# EasyEDA Pro project STM32设计.eprj

# Schematic STM32系统
Create Date: 2024-05-22; Page Name: P1; Project Name: STM32设计; Schematic Name: STM32系统; Update Date: 2024-09-18; Company: WWC; Page Size: A4; Version: V1.0
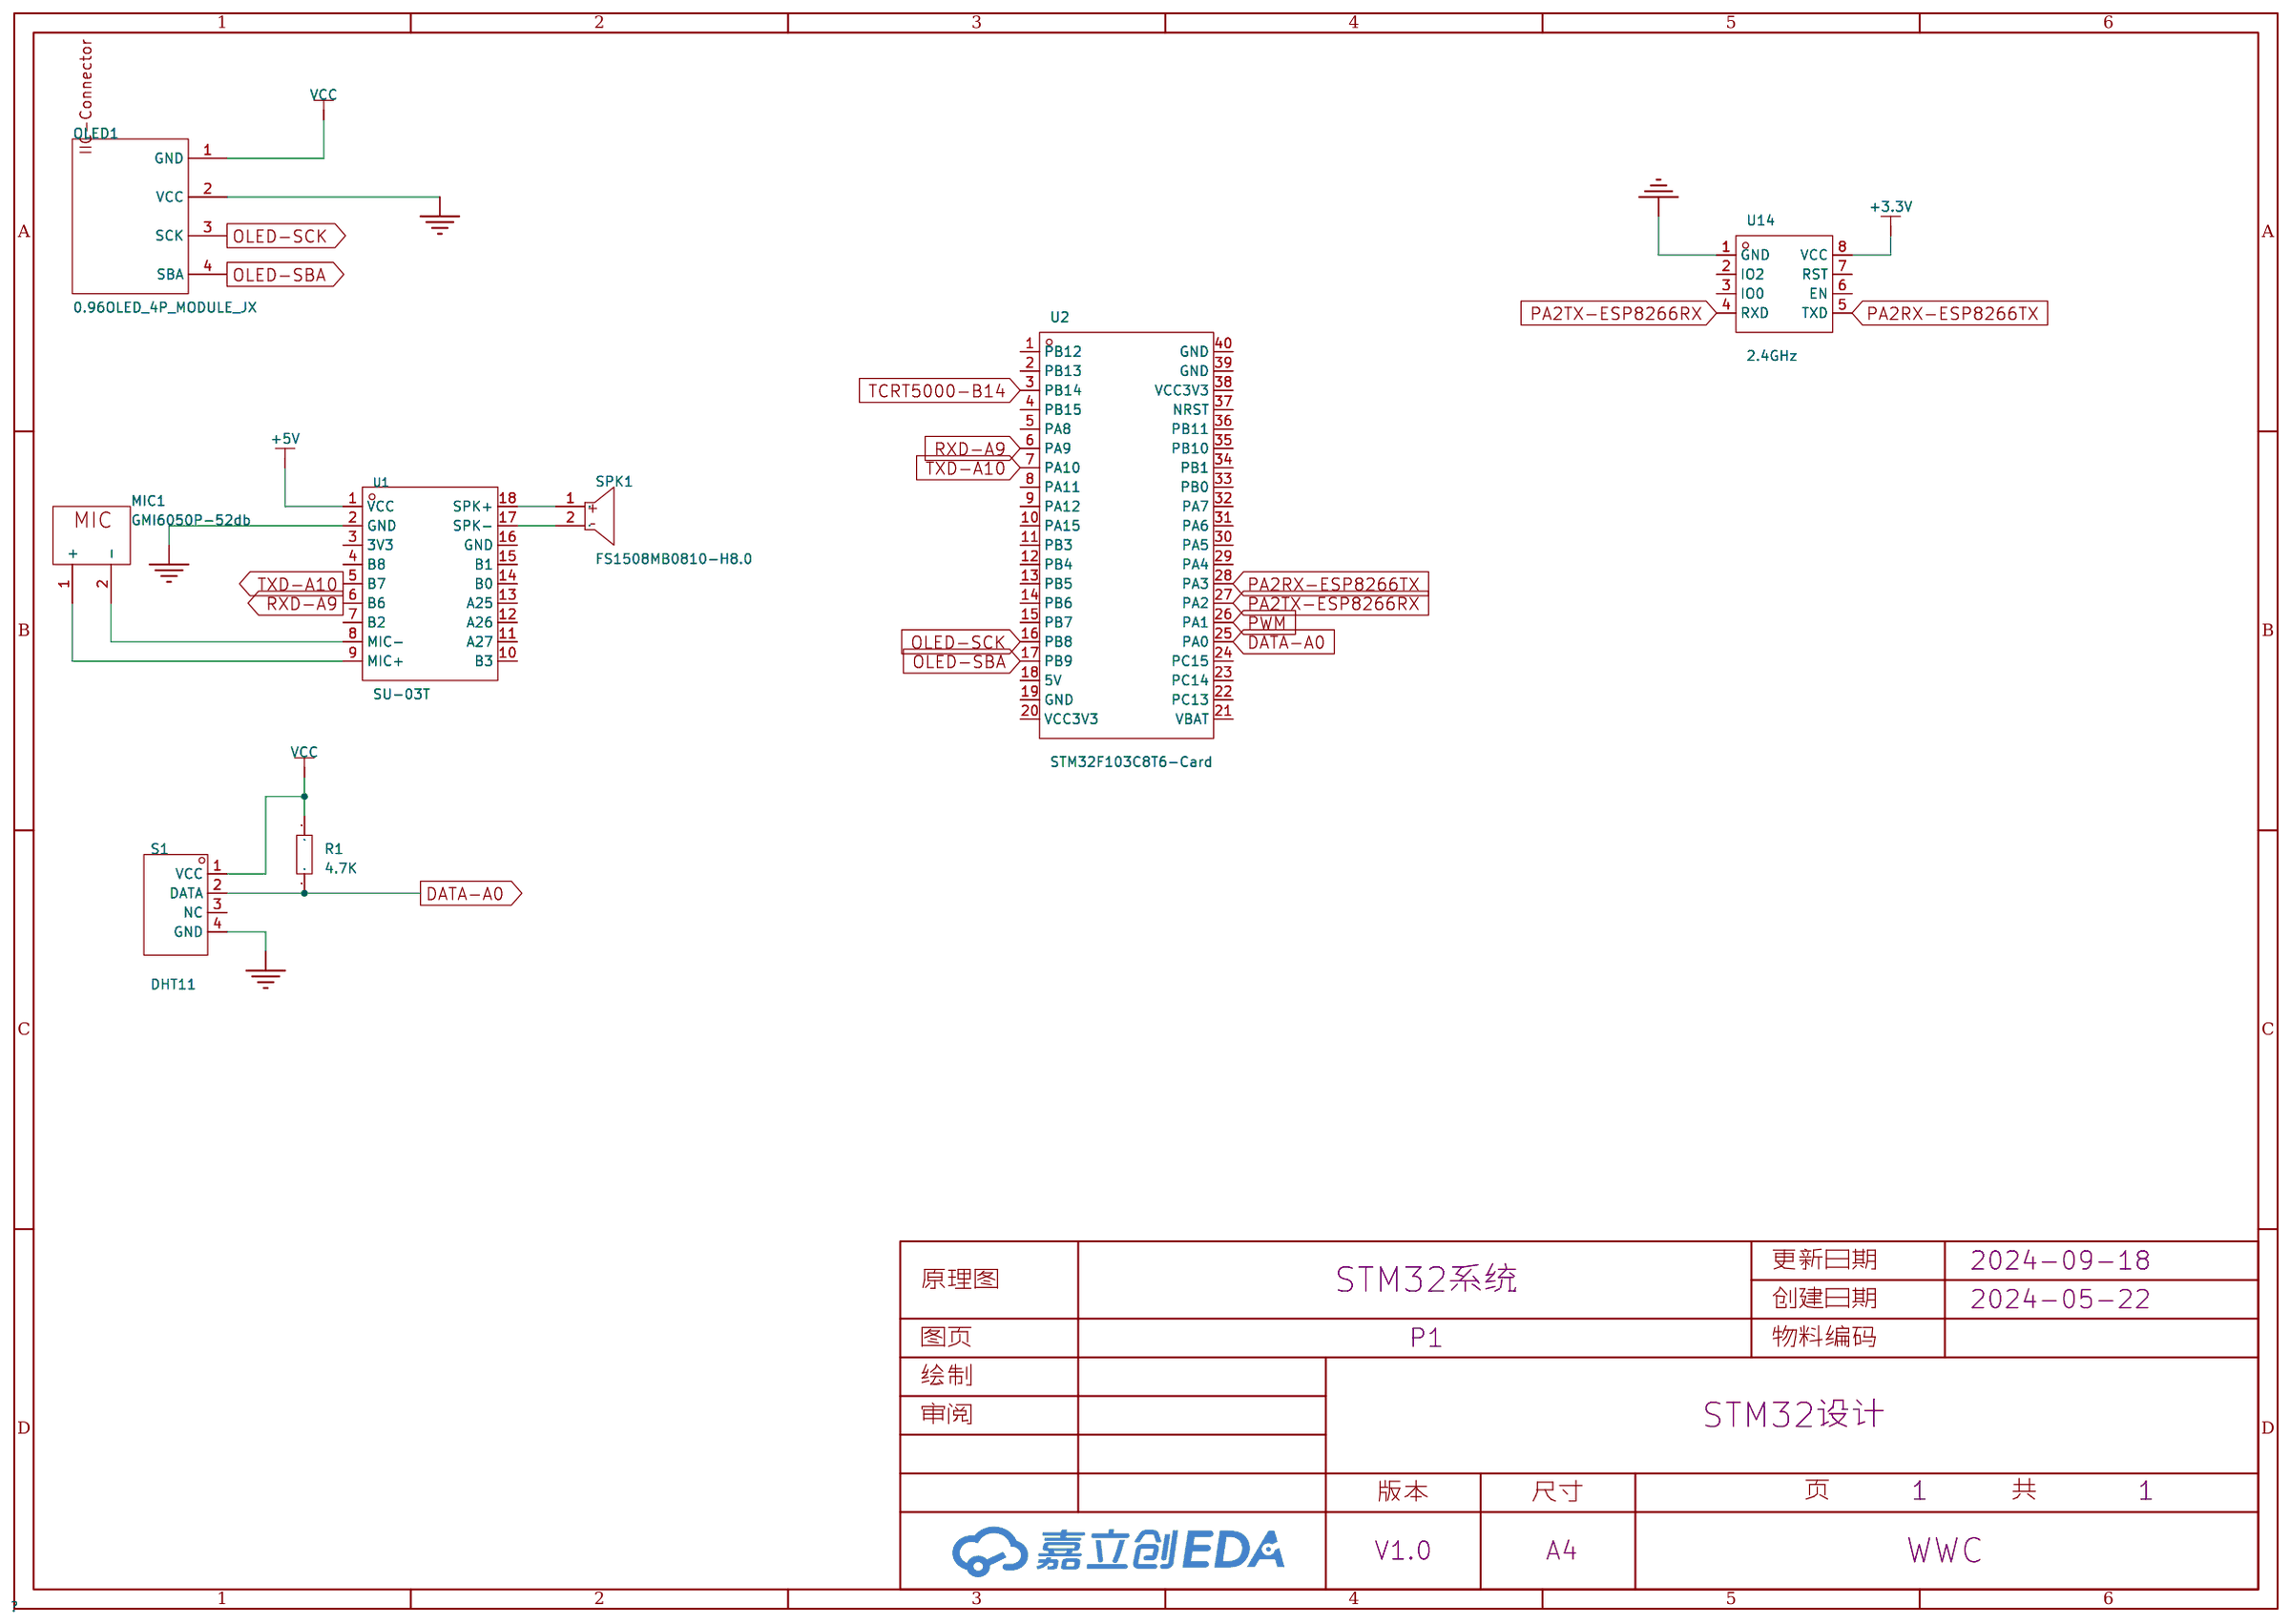
[diagram p0: schematic sheet]

## Parts
MIC1  GMI6050P-52db  [MIC-TH_BD6.0-P2.00]
OLED1  0.96OLED_4P_MODULE_JX  [0.96OLED_4P]
R1  4.7K  [R0805]
S1  DHT11  [SENSOR-TH_DHT11-1]
SPK1  FS1508MB0810-H8.0  [BEEP-TH_BD15.0-P10.20-D1.2]
U1  SU-03T  [COMM-SMD_18P-L21.0-W15.0-P2.00]
U2  STM32F103C8T6-Card  [CONN-TH_L53.3-W22.9_STM32F103C8T6-CARD]
U14  2.4GHz  [WIFIM-TH_8P-L24.7-W14.4-P2.54]

## Library data of the parts
MIC1 = GMI6050P-52db: LCSC Part Name: 全指向φ6.0*5.0mm 1.5V-10V 灵敏度-52db 低阻抗 针脚; Supplier Part: C233947; Manufacturer: INGHAi(赢海); Supplier Footprint: 插件,D=6mm; JLCPCB Part Class: 扩展库; Datasheet: https://atta.szlcsc.com/upload/public/pdf/source/20180613/C233951_CF3F103FE3546E5F8FCD1BC0597FF08F.pdf; Supplier: LCSC
OLED1 = 0.96OLED_4P_MODULE_JX: Supplier Part: C9900004566; Supplier Footprint: 插件; JLCPCB Part Class: 扩展库; Supplier: LCSC
R1 = RMC08054.7K5%N: 阻值:4.7kΩ;精度:±5%;功率:125mW;; LCSC Part Name: 4.7kΩ ±5% 125mW; Supplier Part: C269733; Manufacturer: Tyohm(幸亚电阻); Supplier Footprint: 0805; JLCPCB Part Class: 扩展库; Datasheet: https://atta.szlcsc.com/upload/public/pdf/source/20190115/C325956_D27151D492FFB3C9AB4A6F14FE01F30A.pdf; Supplier: LCSC; Tolerance: ±5%; Power(Watts): 125mW
S1 = DHT11_C87032: 温湿度模块，数字式，单总线; LCSC Part Name: DHT11  电阻式; Supplier Part: C87032; Supplier Footprint: 16.1x12.6x5.8mm; JLCPCB Part Class: 扩展库; Supplier: LCSC
SPK1 = FS1508MB0810-H8.0: 插针; LCSC Part Name: 喇叭; Supplier Part: C969972; Manufacturer: FUET(福声科技); JLCPCB Part Class: 扩展库; Datasheet: https://atta.szlcsc.com/upload/public/pdf/source/20201214/C969972_AF680FD4EA01CCA3A240B6D561BC4FD9.pdf; Supplier: LCSC
U1 = SU-03T: 处理器:-;运行内存:-;USB:-;WIFI协议:-;蓝牙:-;以太网:-;; Supplier Part: C879203; Manufacturer: MACHINE INTELLIGENCE(机芯智能); JLCPCB Part Class: 扩展库; Datasheet: https://atta.szlcsc.com/upload/public/pdf/source/20201029/C879203_F32AEAE676882DD706CDA0C6D57F9671.pdf; Supplier: LCSC
U2 = STM32F103C8T6-Card: Supplier Part: C9900077949; Supplier Footprint: 插件; Supplier: LCSC
U14 = ESP-01S: 核心处理器:ESP8266芯片;频率:2.4GHz;天线形式:板载PCB天线;发射功率:16dBm;接收灵敏度:-90dBm;; LCSC Part Name: 完整的802.11b/g/nWi-FiSoC模块; Supplier Part: C503582; Manufacturer: Ai-Thinker(安信可); JLCPCB Part Class: 扩展库; Datasheet: https://atta.szlcsc.com/upload/public/pdf/source/20200407/C503582_1139AF8FB42E05635FA0089E1752A536.pdf; Supplier: LCSC; Core Processor: ESP8266芯片; Support Interface: GPIO；UART；PWM; Antenna Type: 板载PCB天线; Output Power: 16dBm; Operating Voltage: 3V~3.6V; Receive  Current: 56mA; Send  Current: 170mA; Sensitivity: -90dBm; Operating Temperature: -20℃~+70℃

## Nets
+3.3V: U14.8(VCC)
+5V: U1.1(VCC)
GND: OLED1.2(VCC) S1.4(GND) U1.2(GND) U14.1(GND)
VCC: OLED1.1(GND) R1.2 S1.1(VCC)
DATA-A0: R1.1 S1.2(DATA) U2.25(PA0)
OLED-SBA: OLED1.4(SBA) U2.17(PB9)
OLED-SCK: OLED1.3(SCK) U2.16(PB8)
PA2RX-ESP8266TX: U2.28(PA3) U14.5(TXD)
PA2TX-ESP8266RX: U2.27(PA2) U14.4(RXD)
PWM: U2.26(PA1)
RXD-A9: U1.6(B6) U2.6(PA9)
TCRT5000-B14: U2.3(PB14)
TXD-A10: U1.5(B7) U2.7(PA10)
$1N2667: MIC1.1(+) U1.9(MIC+)
$1N2671: MIC1.2(-) U1.8(MIC-)
$1N2735: SPK1.1 U1.18(SPK+)
$1N2739: SPK1.2 U1.17(SPK-)

Not connected (* = marked no-connect by the designer): S1 3(NC); U1 3(3V3) 4(B8) 7(B2) 10(B3) 11(A27) 12(A26) 13(A25) 14(B0) 15(B1) 16(GND); U2 1(PB12) 2(PB13) 4(PB15) 5(PA8) 8(PA11) 9(PA12) 10(PA15) 11(PB3) 12(PB4) 13(PB5) 14(PB6) 15(PB7) 18(5V) 19(GND) 20(VCC3V3) 21(VBAT) 22(PC13) 23(PC14) 24(PC15) 29(PA4) 30(PA5) 31(PA6) 32(PA7) 33(PB0) 34(PB1) 35(PB10) 36(PB11) 37(NRST) 38(VCC3V3) 39(GND) 40(GND); U14 2(IO2) 3(IO0) 6(EN) 7(RST)

# Schematic Schematic1
Create Date: 2024-09-17; Page Name: P1; Project Name: STM32设计; Schematic Name: Schematic1; Update Date: 2024-09-18; Company: WWC; Page Size: A4; Version: V1.0
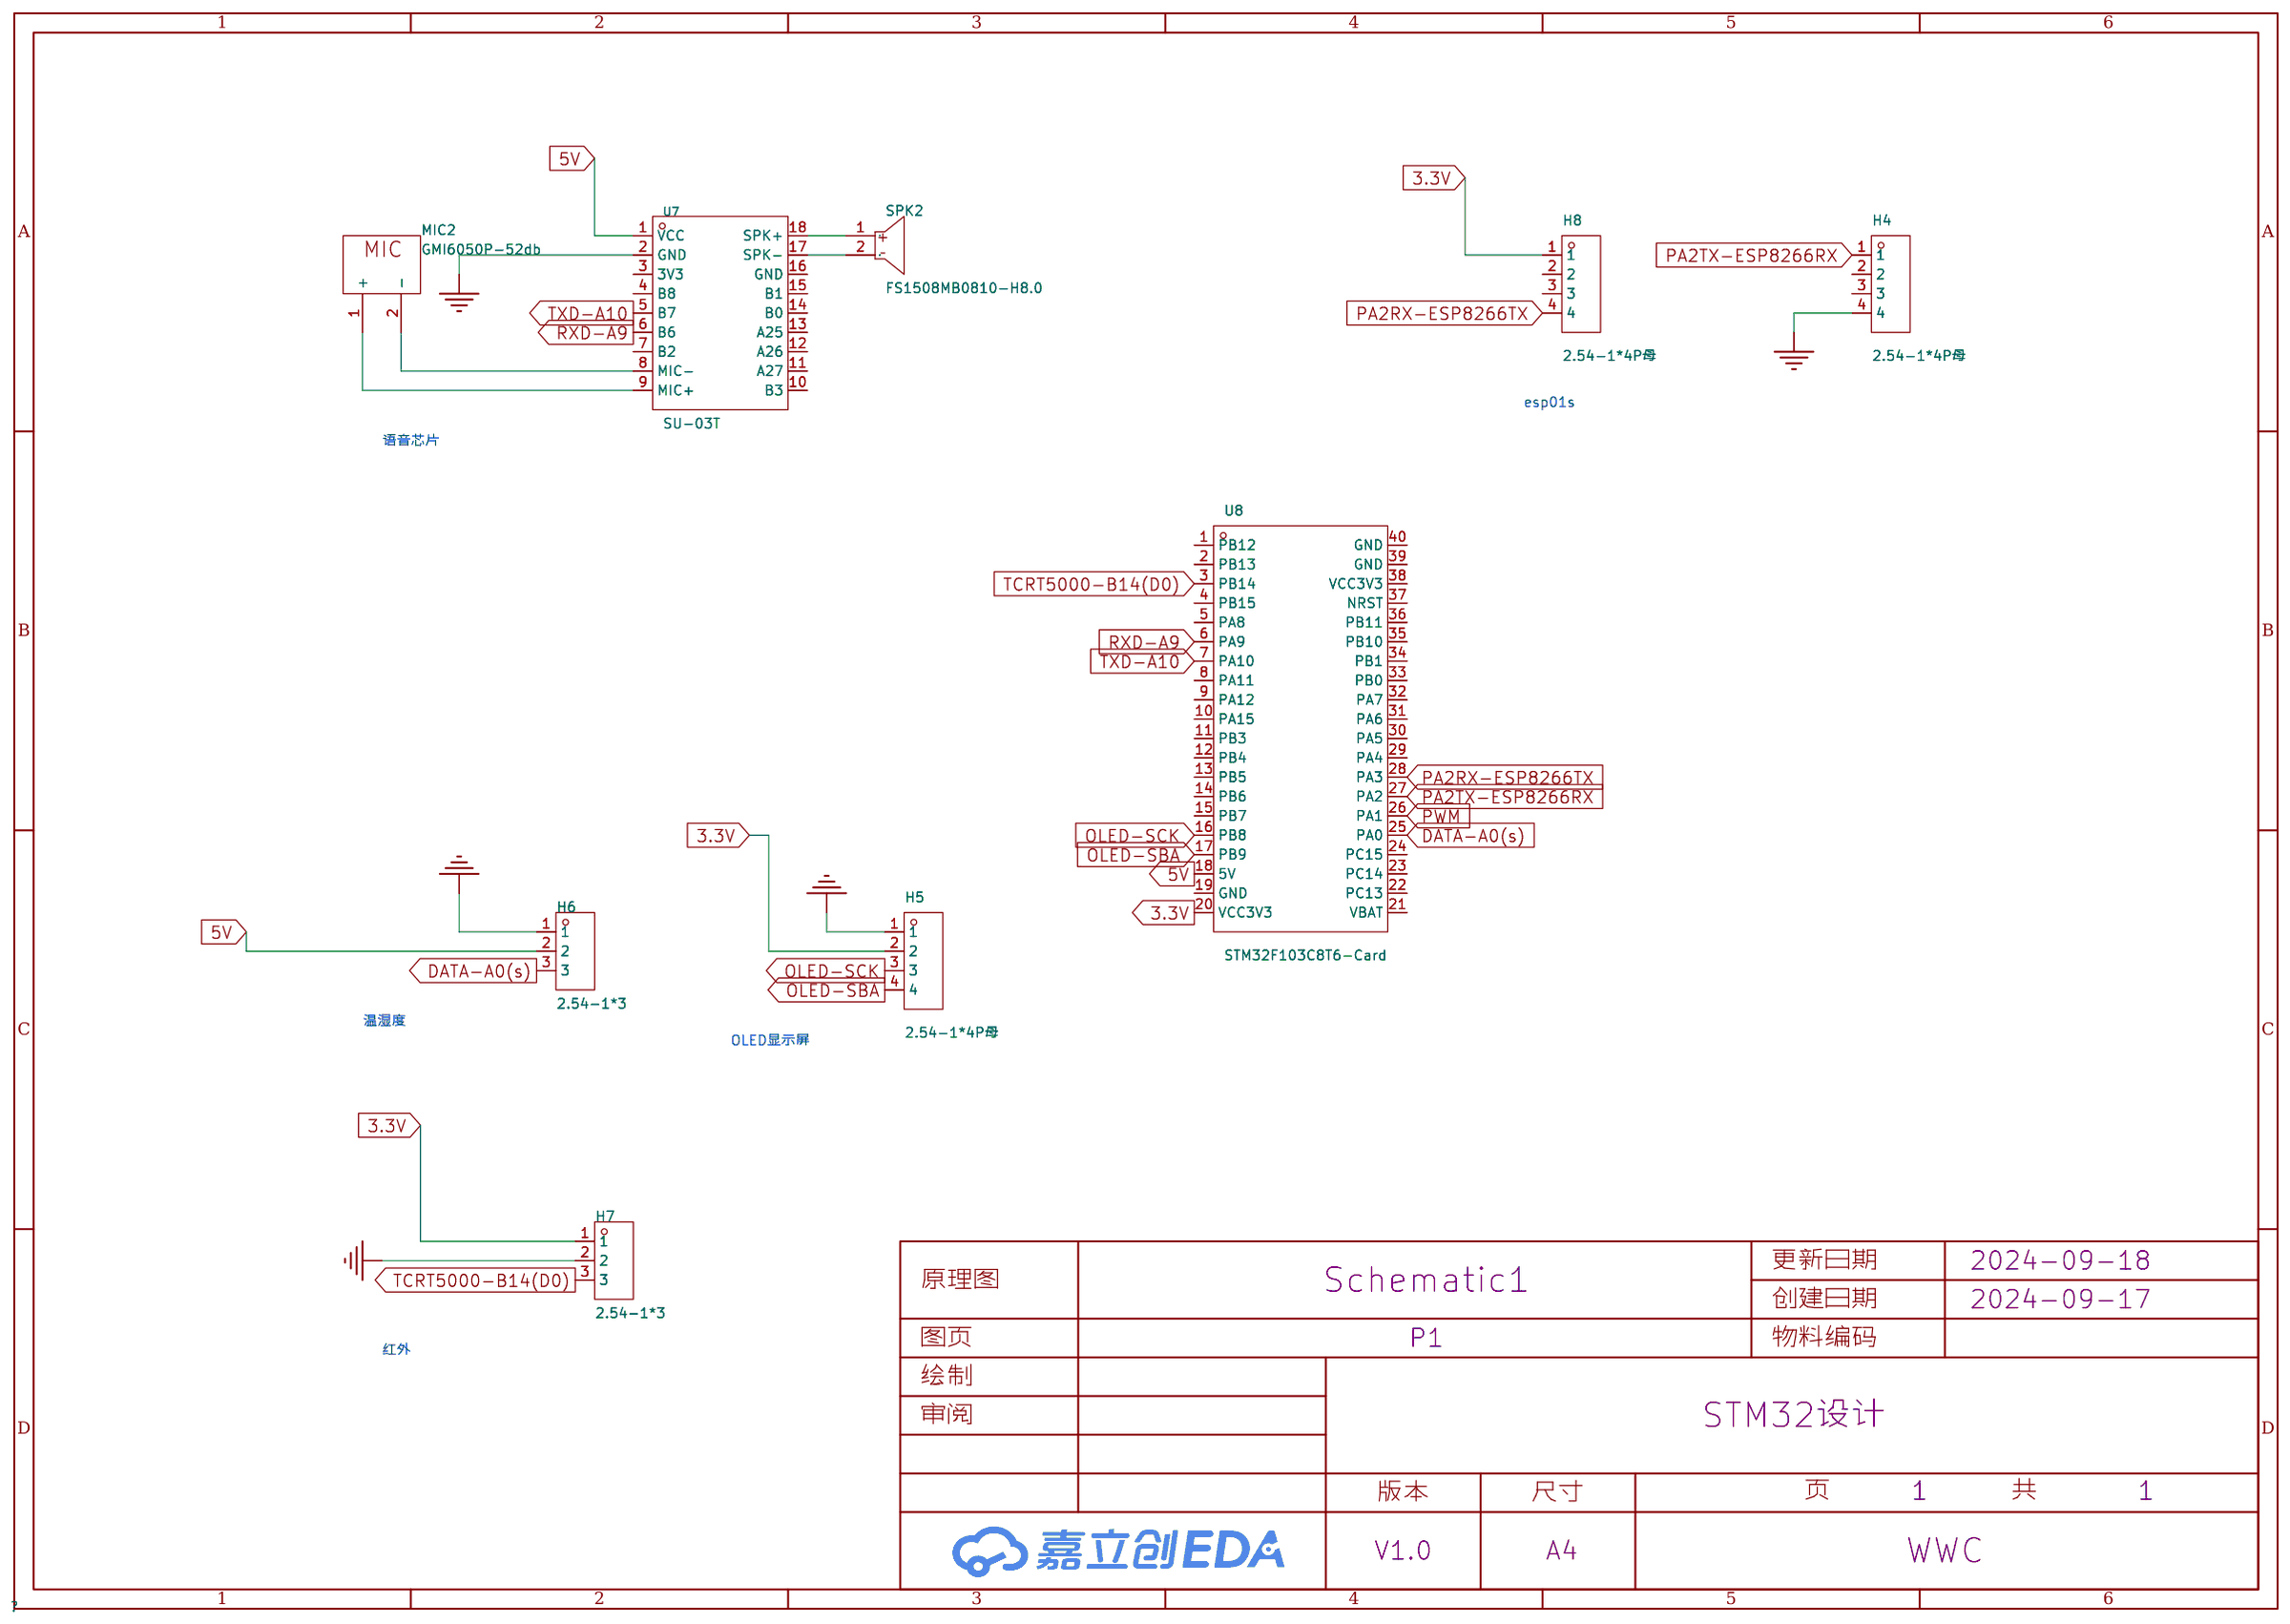
[diagram p1: schematic sheet]

## Parts
H4  2.54-1*4P母  [HDR-TH_4P-P2.54-V-F]
H5  2.54-1*4P母  [HDR-TH_4P-P2.54-V-F]
H6  2.54-1*3  [HDR-TH_3P-P2.54-V-M-1]
H7  2.54-1*3  [HDR-TH_3P-P2.54-V-M-1]
H8  2.54-1*4P母  [HDR-TH_4P-P2.54-V-F]
MIC2  GMI6050P-52db  [MIC-TH_BD6.0-P2.00]
SPK2  FS1508MB0810-H8.0  [BEEP-TH_BD15.0-P10.20-D1.2]
U7  SU-03T  [COMM-SMD_18P-L21.0-W15.0-P2.00]
U8  STM32F103C8T6-Card  [CONN-TH_L53.3-W22.9_STM32F103C8T6-CARD]

## Library data of the parts
H4 H5 H8 = 2.54-1*4P母: 插孔结构:1x4P;间距:2.54mm;行距:-;圆孔/方孔:方孔;安装类型:直插;排数:单排;总孔位数:4P;额定电流:3A;额定电压:-;插孔方向:顶部;塑高:-;触头材质:青铜;触头镀层:-;工作温度范围:-40℃~+105℃;焊接温度(最大值):-;; LCSC Part Name: 间距:2.54mm 1x4P 直插; Supplier Part: C2718488; Manufacturer: BOOMELE(博穆精密); Supplier Footprint: 插件,P=2.54mm; JLCPCB Part Class: 扩展库; Datasheet: https://atta.szlcsc.com/upload/public/pdf/source/20210301/C2718488_F4427B881E42CAA8DDB0B1C12B3A522C.pdf; Supplier: LCSC; Holes Structure: 1x4P; Pitch: 2.54mm; Circular Hole / Square Hole: 方孔; Mounting Type: 直插; Number of Rows: 单排; Number of Holes: 4P; Current Rating (Max): 3A; Holes Direction: 顶部; Contact Material: 青铜; Operating Temperature Range: -40℃~+105℃
H6 H7 = 2.54-1*3: 插针结构:1x3P;间距:2.54mm;排数:单排;总PIN位数:3P;触头镀层:金;; LCSC Part Name: 停产; Supplier Part: C5116482; Manufacturer: ZHOURI(洲日); Supplier Footprint: 插件,P=2.54mm; JLCPCB Part Class: 扩展库; Datasheet: https://atta.szlcsc.com/upload/public/pdf/source/20220729/4DB71EF9013296CFACD97372BAB8A1F0.pdf; Supplier: LCSC; Pin Structure: 1x3P; Pitch: 2.54mm; Number of Rows: 单排; Number of Pins: 3P; Contact Plating: 金
MIC2 = GMI6050P-52db: LCSC Part Name: 全指向φ6.0*5.0mm 1.5V-10V 灵敏度-52db 低阻抗 针脚; Supplier Part: C233947; Manufacturer: INGHAi(赢海); Supplier Footprint: 插件,D=6mm; JLCPCB Part Class: 扩展库; Datasheet: https://atta.szlcsc.com/upload/public/pdf/source/20180613/C233951_CF3F103FE3546E5F8FCD1BC0597FF08F.pdf; Supplier: LCSC
SPK2 = FS1508MB0810-H8.0: 插针; LCSC Part Name: 喇叭; Supplier Part: C969972; Manufacturer: FUET(福声科技); JLCPCB Part Class: 扩展库; Datasheet: https://atta.szlcsc.com/upload/public/pdf/source/20201214/C969972_AF680FD4EA01CCA3A240B6D561BC4FD9.pdf; Supplier: LCSC
U7 = SU-03T: 处理器:-;运行内存:-;USB:-;WIFI协议:-;蓝牙:-;以太网:-;; Supplier Part: C879203; Manufacturer: MACHINE INTELLIGENCE(机芯智能); JLCPCB Part Class: 扩展库; Datasheet: https://atta.szlcsc.com/upload/public/pdf/source/20201029/C879203_F32AEAE676882DD706CDA0C6D57F9671.pdf; Supplier: LCSC
U8 = STM32F103C8T6-Card: Supplier Part: C9900077949; Supplier Footprint: 插件; Supplier: LCSC

## Nets
3.3V: H5.2 H7.1 H8.1 U8.20(VCC3V3)
5V: H6.2 U7.1(VCC) U8.18(5V)
GND: H4.4 H5.1 H6.1 H7.2 U7.2(GND)
DATA-A0(s): H6.3 U8.25(PA0)
OLED-SBA: H5.4 U8.17(PB9)
OLED-SCK: H5.3 U8.16(PB8)
PA2RX-ESP8266TX: H8.4 U8.28(PA3)
PA2TX-ESP8266RX: H4.1 U8.27(PA2)
PWM: U8.26(PA1)
RXD-A9: U7.6(B6) U8.6(PA9)
TCRT5000-B14(D0): H7.3 U8.3(PB14)
TXD-A10: U7.5(B7) U8.7(PA10)
$1N804: MIC2.1(+) U7.9(MIC+)
$1N805: MIC2.2(-) U7.8(MIC-)
$1N806: SPK2.1 U7.18(SPK+)
$1N807: SPK2.2 U7.17(SPK-)

Not connected (* = marked no-connect by the designer): H4 2 3; H8 2 3; U7 3(3V3) 4(B8) 7(B2) 10(B3) 11(A27) 12(A26) 13(A25) 14(B0) 15(B1) 16(GND); U8 1(PB12) 2(PB13) 4(PB15) 5(PA8) 8(PA11) 9(PA12) 10(PA15) 11(PB3) 12(PB4) 13(PB5) 14(PB6) 15(PB7) 19(GND) 21(VBAT) 22(PC13) 23(PC14) 24(PC15) 29(PA4) 30(PA5) 31(PA6) 32(PA7) 33(PB0) 34(PB1) 35(PB10) 36(PB11) 37(NRST) 38(VCC3V3) 39(GND) 40(GND)

## Notes on the sheet
- esp01s
- 语音芯片
- 温湿度
- OLED显示屏
- 红外

# Board PCB1
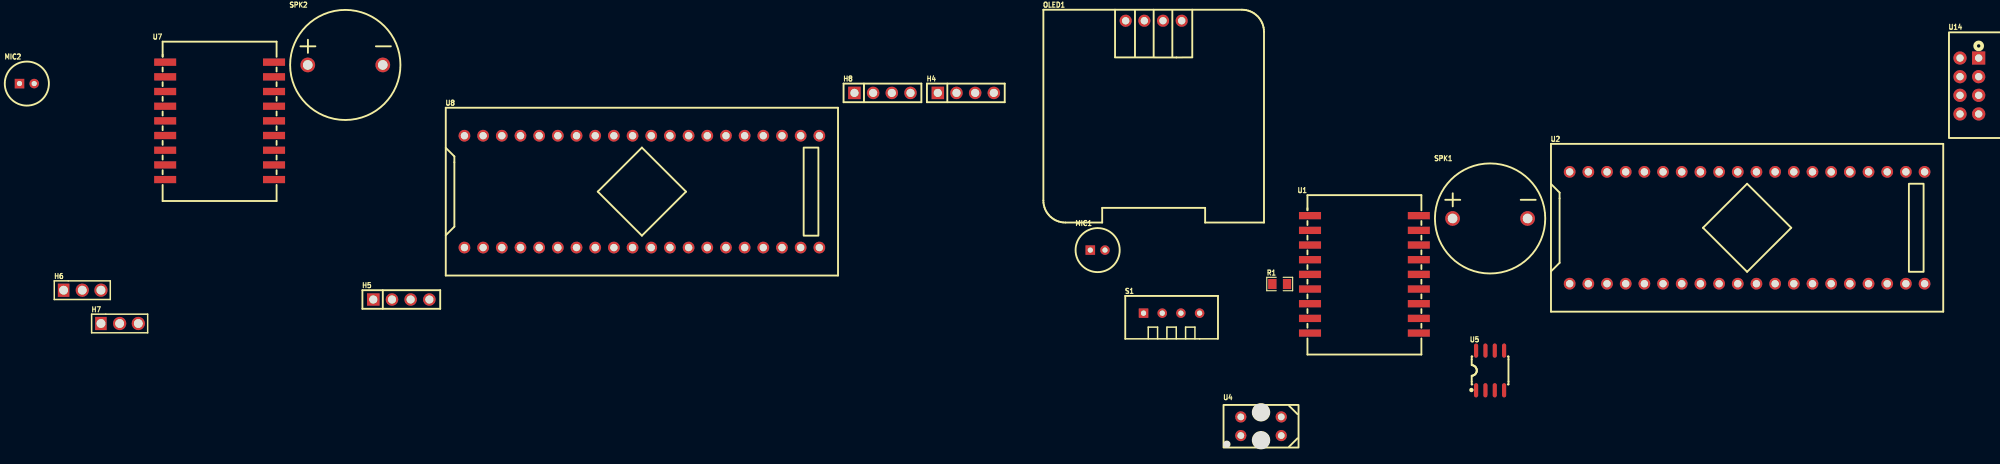
[diagram p2: board, top side]
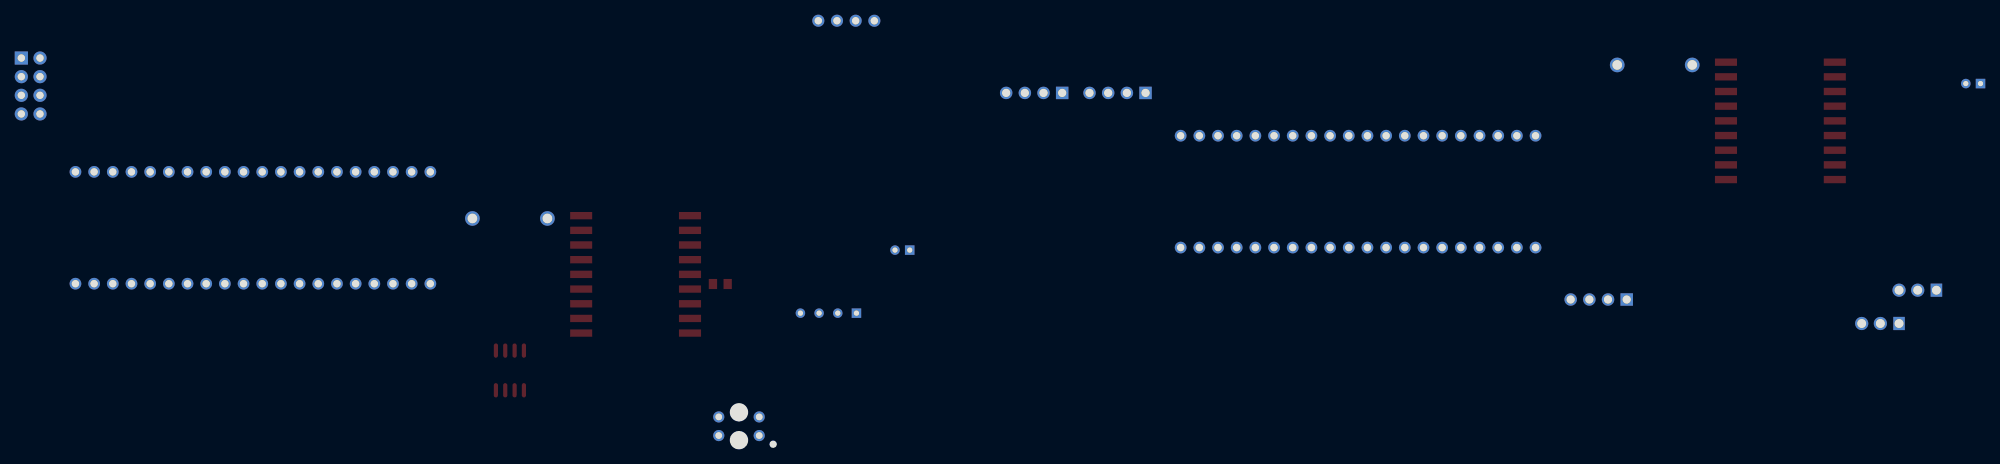
[diagram p3: board, bottom side, seen from below]

Outline 6.39 x 6.29 mm; copper layers: Top Layer, Bottom Layer. Coordinates in mm from the lower left corner of the outline.
Stack: Top Layer 0.035mm / Dielectric1 1.51mm FR4 er 4.5 / Bottom Layer 0.035mm

## Design rules (mm)
template: JLCPCB Capability(Two Layers Board)
spacing copperThickness1oz (default): track to track 0.102, other pairs 0.152 to 0.3
spacing copperThickness2oz: track to track 0.203, other pairs 0.152 to 0.3
track width copperThickness1oz (default): min 0.127, default 0.254, max 2.54
track width copperThickness2oz: min 0.203, default 0.254, max 2.54
differential pair differentialPair (default): width min 0.127, default 0.254, max 2.54; gap min 0.152, default 0.152
via viaSize (default): diameter min 0.5, default 0.61, max 10; hole min 0.3, default 0.305, max 6.3

## Placement (name value [footprint] x y rotation side)
H4  2.54-1*4P母  [HDR-TH_4P-P2.54-V-F]  -35 48.57 0 top
H5  2.54-1*4P母  [HDR-TH_4P-P2.54-V-F]  -111.76 20.41 0 top
H6  2.54-1*3  [HDR-TH_3P-P2.54-V-M-1]  -155.14 21.68 0 top
H7  2.54-1*3  [HDR-TH_3P-P2.54-V-M-1]  -150.06 17.15 0 top
H8  2.54-1*4P母  [HDR-TH_4P-P2.54-V-F]  -46.33 48.57 0 top
MIC1  GMI6050P-52db  [MIC-TH_BD6.0-P2.00]  -17.07 27.15 0 top
MIC2  GMI6050P-52db  [MIC-TH_BD6.0-P2.00]  -162.68 49.84 0 top
OLED1  0.96OLED_4P_MODULE_JX  [0.96OLED_4P]  -9.45 58.4 0 top
R1  4.7K  [R0805]  7.69 22.53 0 top
S1  DHT11  [SENSOR-TH_DHT11-1]  -7.02 18.56 0 top
SPK1  FS1508MB0810-H8.0  [BEEP-TH_BD15.0-P10.20-D1.2]  36.29 31.46 0 top
SPK2  FS1508MB0810-H8.0  [BEEP-TH_BD15.0-P10.20-D1.2]  -119.38 52.38 0 top
U1  SU-03T  [COMM-SMD_18P-L21.0-W15.0-P2.00]  19.21 23.84 0 top
U2  STM32F103C8T6-Card  [CONN-TH_L53.3-W22.9_STM32F103C8T6-CARD]  71.24 30.19 0 top
U4  TCRT5000  [OPTO-TH_TCRT5000]  5.15 3.15 0 top
U5  LM393DR2G  [SOIC-8_L5.0-W4.0-P1.27-LS6.0-BL]  36.29 10.75 0 top
U7  SU-03T  [COMM-SMD_18P-L21.0-W15.0-P2.00]  -136.47 44.76 0 top
U8  STM32F103C8T6-Card  [CONN-TH_L53.3-W22.9_STM32F103C8T6-CARD]  -79.04 35.11 0 top
U14  2.4GHz  [WIFIM-TH_8P-L24.7-W14.4-P2.54]  101.46 49.51 0 top

## Footprints (pads in the part's own frame, mm; a bottom-side part is the same pattern mirrored in y, then rotated)
0.96OLED_4P
  round 1.65 hole 1: 1(-3.81,-0.002) 2(-1.27,0.002) 3(1.27,0.002) 4(3.81,0.002)
BEEP-TH_BD15.0-P10.20-D1.2
  round 2 hole 1.3: 1(-5.1,0) 2(5.1,0)
COMM-SMD_18P-L21.0-W15.0-P2.00
  rect 3x1 smd: 1(-7.4,8) 2(-7.4,6) 3(-7.4,4) 4(-7.4,2) 5(-7.4,0) 6(-7.4,-2.001) 7(-7.4,-4) 8(-7.4,-6) 9(-7.4,-8) 10(7.4,-8) 11(7.4,-6) 12(7.4,-4) 13(7.4,-2) 14(7.4,0) 15(7.4,2) 16(7.4,4) 17(7.4,6) 18(7.4,8)
CONN-TH_L53.3-W22.9_STM32F103C8T6-CARD
  round 1.6 hole 1: 1(-24.13,-7.62) 2(-21.59,-7.62) 3(-19.05,-7.62) 4(-16.51,-7.62) 5(-13.97,-7.62) 6(-11.43,-7.62) 7(-8.89,-7.62) 8(-6.35,-7.62) 9(-3.81,-7.62) 10(-1.27,-7.62) 11(1.27,-7.62) 12(3.81,-7.62) 13(6.35,-7.62) 14(8.89,-7.62) 15(11.43,-7.62) 16(13.97,-7.62) 17(16.51,-7.62) 18(19.05,-7.62) 19(21.59,-7.62) 20(24.13,-7.62) 21(24.13,7.62) 22(21.59,7.62) 23(19.05,7.62) 24(16.51,7.62) 25(13.97,7.62) 26(11.43,7.62) 27(8.89,7.62) 28(6.35,7.62) 29(3.81,7.62) 30(1.27,7.62) 31(-1.27,7.62) 32(-3.81,7.62) 33(-6.35,7.62) 34(-8.89,7.62) 35(-11.43,7.62) 36(-13.97,7.62) 37(-16.51,7.62) 38(-19.05,7.62) 39(-21.59,7.62) 40(-24.13,7.62)
HDR-TH_3P-P2.54-V-M-1
  rect 1.575x1.8 hole 1.2: 1(-2.54,0)
  round 1.8 hole 1.2: 2(0,0) 3(2.54,0)
HDR-TH_4P-P2.54-V-F
  rect 1.7x1.7 hole 1.1: 1(-3.81,0)
  round 1.7 hole 1.1: 2(-1.27,0) 3(1.27,0) 4(3.81,0)
MIC-TH_BD6.0-P2.00
  rect 1.3x1.3 hole 0.7: 1(-1,0)
  round 1.3 hole 0.7: 2(1,0)
OPTO-TH_TCRT5000
  round 1.524 hole 0.914: 1(2.75,1.27) 2(2.75,-1.27) 3(-2.75,-1.27) 4(-2.75,1.27)
R0805
  rect 1.133x1.377 smd: 1(-1,0) 2(1,0)
SENSOR-TH_DHT11-1
  rect 1.296x1.296 hole 0.711: 1(-3.81,0)
  round 1.296 hole 0.711: 2(-1.27,0) 3(1.27,0) 4(3.81,0)
SOIC-8_L5.0-W4.0-P1.27-LS6.0-BL
  oval 0.569x1.95 smd: 1(-1.905,-2.705) 2(-0.635,-2.705) 3(0.635,-2.705) 4(1.905,-2.705) 5(1.905,2.705) 6(0.635,2.705) 7(-0.635,2.705) 8(-1.905,2.705)
WIFIM-TH_8P-L24.7-W14.4-P2.54
  rect 1.8x1.8 hole 1: 1(1.27,3.81)
  round 1.8 hole 1: 2(1.27,1.27) 3(1.27,-1.27) 4(1.27,-3.81) 5(-1.27,3.81) 6(-1.27,1.27) 7(-1.27,-1.27) 8(-1.27,-3.81)

## Nets
+3.3V: H5.2 H7.1 H8.1 U14.8
+5V: H6.2 U1.1 U7.1
GND: H4.4 H5.1 H6.1 H7.2 OLED1.2 S1.4 U1.2 U4.2 U4.3 U5.4 U7.2 U14.1
VCC: OLED1.1 R1.2 S1.1
DATA-A0: R1.1 S1.2 U2.25
DATA-A0(S): H6.3 U8.25
OLED-SBA: H5.4 OLED1.4 U2.17 U8.17
OLED-SCK: H5.3 OLED1.3 U2.16 U8.16
PA2RX-ESP8266TX: H8.4 U2.28 U8.28 U14.5
PA2TX-ESP8266RX: H4.1 U2.27 U8.27 U14.4
PWM: U2.26 U8.26
RXD-A9: U1.6 U2.6 U7.6 U8.6
TCRT5000-B14: U2.3 U5.7
TCRT5000-B14(D0): H7.3 U8.3
TXD-A10: U1.5 U2.7 U7.5 U8.7
$1N2667: MIC1.1 U1.9
$1N2671: MIC1.2 U1.8
$1N2735: SPK1.1 U1.18
$1N2739: SPK1.2 U1.17
$1N6582: U4.4 U5.3
$2N1426: MIC2.1 U7.9
$2N1427: MIC2.2 U7.8
$2N1428: SPK2.1 U7.18
$2N1429: SPK2.2 U7.17

Pads without a net: H4 2 3; H8 2 3; S1 3; U1 3 4 7 10 11 12 13 14 15 16; U2 1 2 4 5 8 9 10 11 12 13 14 15 18 19 20 21 22 23 24 29 30 31 32 33 34 35 36 37 38 39 40; U4 1; U5 1 2 5 6 8; U7 3 4 7 10 11 12 13 14 15 16; U8 1 2 4 5 8 9 10 11 12 13 14 15 18 19 20 21 22 23 24 29 30 31 32 33 34 35 36 37 38 39 40; U14 2 3 6 7

# Board PCB2
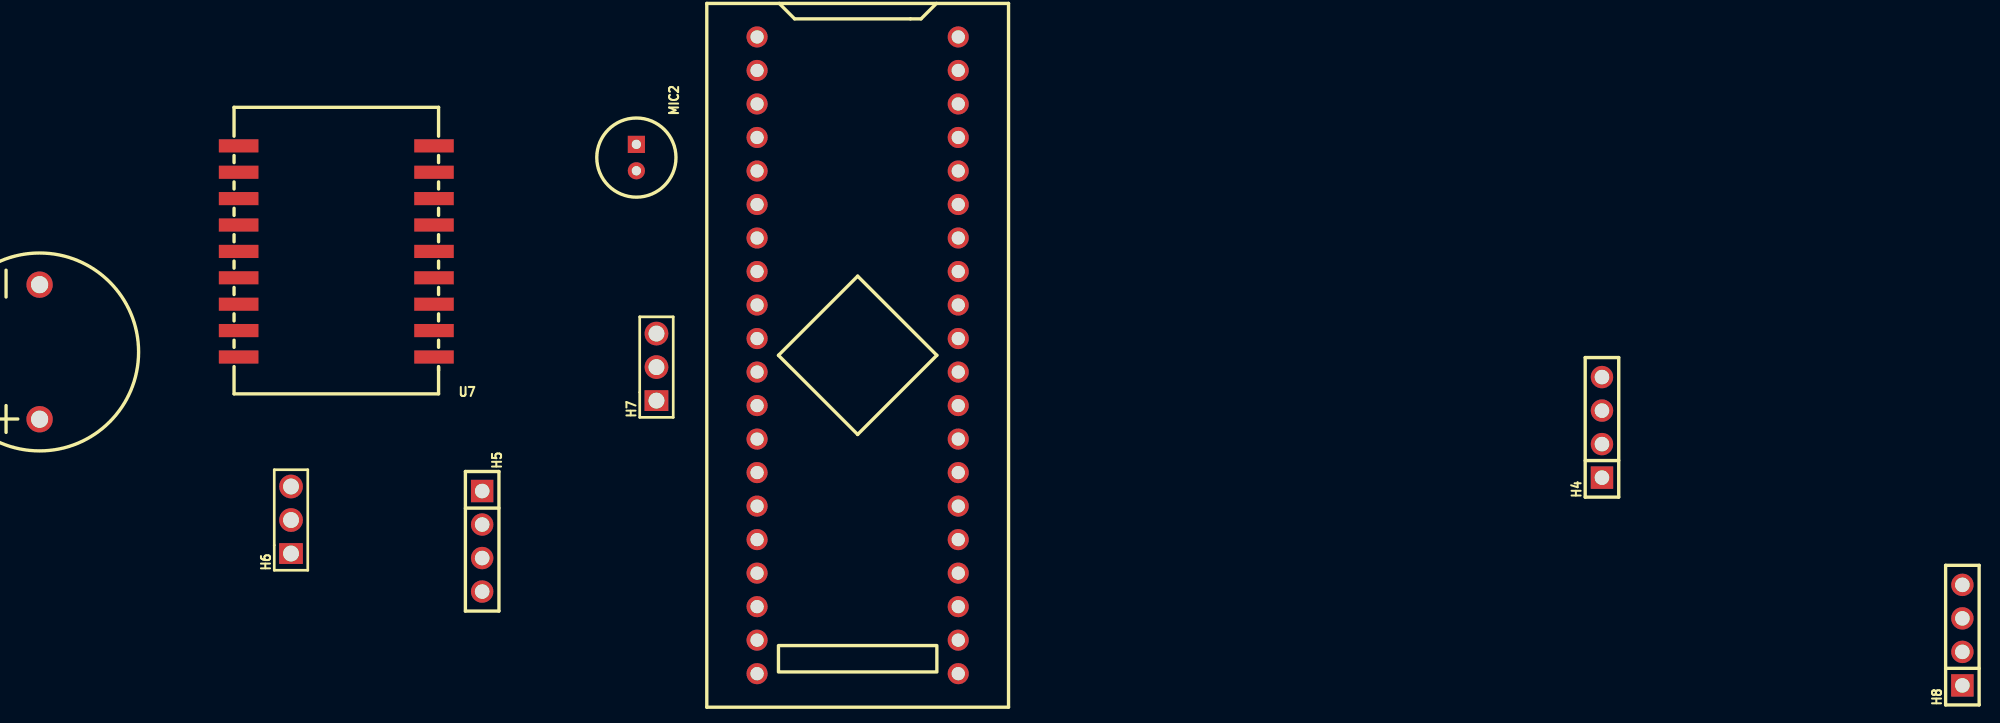
[diagram p4: board, top side]
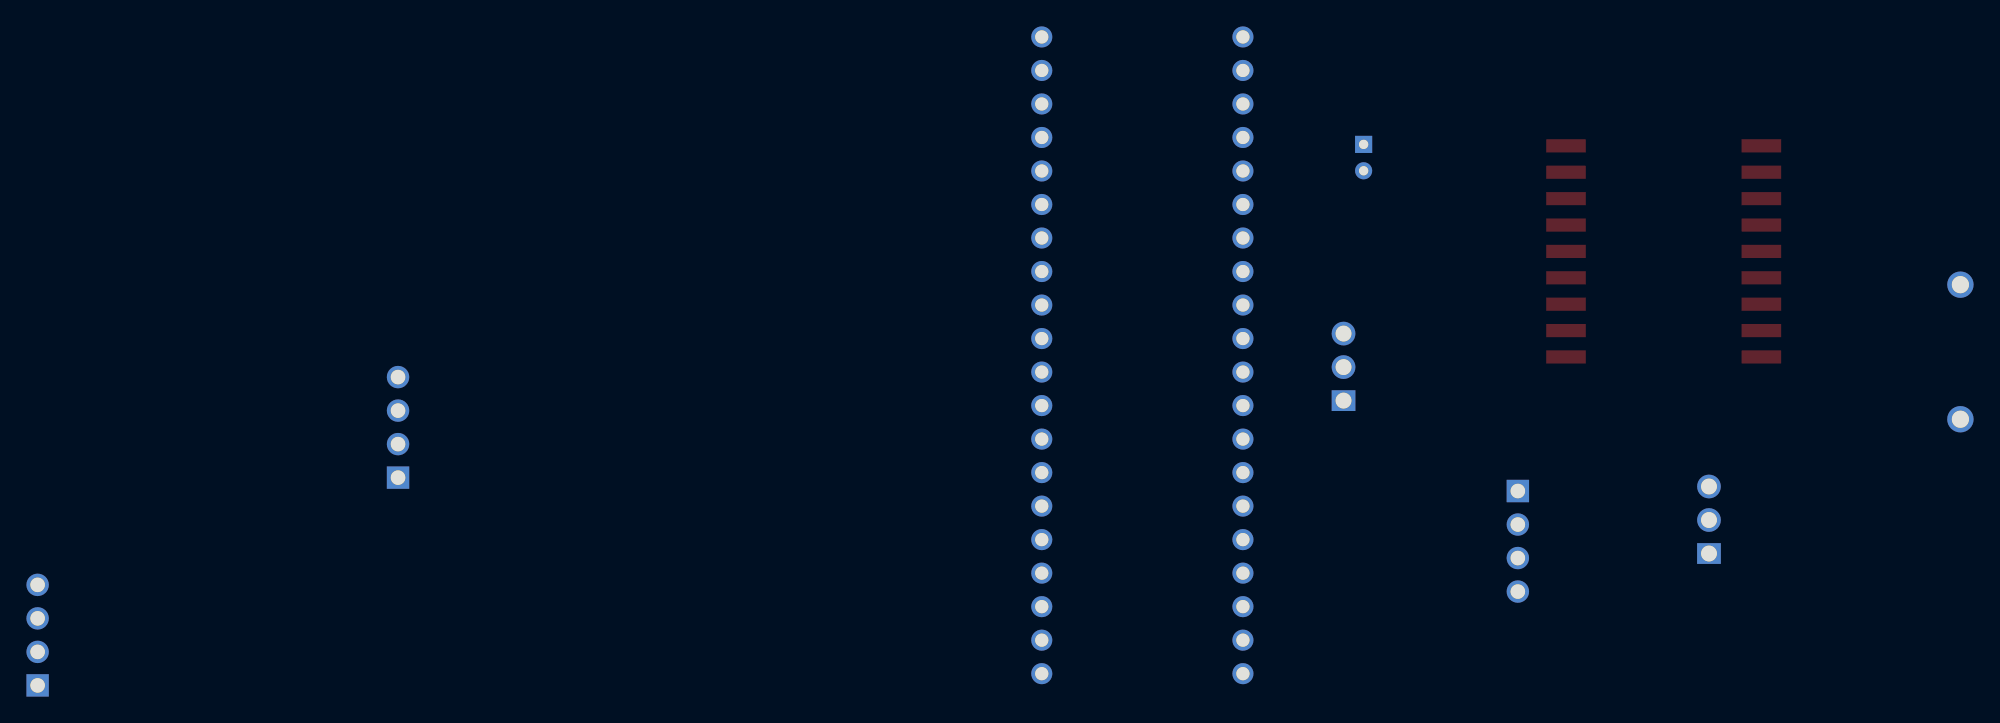
[diagram p5: board, bottom side, seen from below]

No outline. copper layers: Top Layer, Bottom Layer. Coordinates in mm from the lowest, leftmost part position.
Stack: Top Layer 0.035mm / Dielectric1 1.51mm FR4 er 4.5 / Bottom Layer 0.035mm

## Design rules (mm)
template: JLCPCB Capability(Two Layers Board)
spacing copperThickness1oz (default): track to track 0.102, other pairs 0.152 to 0.3
spacing copperThickness2oz: track to track 0.203, other pairs 0.152 to 0.3
track width copperThickness1oz (default): min 0.127, default 0.254, max 2.54
track width copperThickness2oz: min 0.203, default 0.254, max 2.54
differential pair differentialPair (default): width min 0.127, default 0.254, max 2.54; gap min 0.152, default 0.152
via viaSize (default): diameter min 0.5, default 0.61, max 10; hole min 0.3, default 0.305, max 6.3

## Placement (name value [footprint] x y rotation side)
H4  2.54-1*4P母  [HDR-TH_4P-P2.54-V-F]  118.36 15.75 90 top
H5  2.54-1*4P母  [HDR-TH_4P-P2.54-V-F]  33.53 7.11 270 top
H6  2.54-1*3  [HDR-TH_3P-P2.54-V-M-1]  19.05 8.73 90 top
H7  2.54-1*3  [HDR-TH_3P-P2.54-V-M-1]  46.73 20.32 90 top
H8  2.54-1*4P母  [HDR-TH_4P-P2.54-V-F]  145.67 0 90 top
MIC2  GMI6050P-52db  [MIC-TH_BD6.0-P2.00]  45.21 36.2 270 top
SPK2  FS1508MB0810-H8.0  [BEEP-TH_BD15.0-P10.20-D1.2]  0 21.46 90 top
U7  SU-03T  [COMM-SMD_18P-L21.0-W15.0-P2.00]  22.48 29.08 180 top
U8  STM32F103C8T6-Card  [CONN-TH_L53.3-W22.9_STM32F103C8T6-CARD]  61.98 21.21 270 top

## Footprints (pads in the part's own frame, mm; a bottom-side part is the same pattern mirrored in y, then rotated)
BEEP-TH_BD15.0-P10.20-D1.2
  round 2 hole 1.3: 1(-5.1,0) 2(5.1,0)
COMM-SMD_18P-L21.0-W15.0-P2.00
  rect 3x1 smd: 1(-7.4,8) 2(-7.4,6) 3(-7.4,4) 4(-7.4,2) 5(-7.4,0) 6(-7.4,-2.001) 7(-7.4,-4) 8(-7.4,-6) 9(-7.4,-8) 10(7.4,-8) 11(7.4,-6) 12(7.4,-4) 13(7.4,-2) 14(7.4,0) 15(7.4,2) 16(7.4,4) 17(7.4,6) 18(7.4,8)
CONN-TH_L53.3-W22.9_STM32F103C8T6-CARD
  round 1.6 hole 1: 1(-24.13,-7.62) 2(-21.59,-7.62) 3(-19.05,-7.62) 4(-16.51,-7.62) 5(-13.97,-7.62) 6(-11.43,-7.62) 7(-8.89,-7.62) 8(-6.35,-7.62) 9(-3.81,-7.62) 10(-1.27,-7.62) 11(1.27,-7.62) 12(3.81,-7.62) 13(6.35,-7.62) 14(8.89,-7.62) 15(11.43,-7.62) 16(13.97,-7.62) 17(16.51,-7.62) 18(19.05,-7.62) 19(21.59,-7.62) 20(24.13,-7.62) 21(24.13,7.62) 22(21.59,7.62) 23(19.05,7.62) 24(16.51,7.62) 25(13.97,7.62) 26(11.43,7.62) 27(8.89,7.62) 28(6.35,7.62) 29(3.81,7.62) 30(1.27,7.62) 31(-1.27,7.62) 32(-3.81,7.62) 33(-6.35,7.62) 34(-8.89,7.62) 35(-11.43,7.62) 36(-13.97,7.62) 37(-16.51,7.62) 38(-19.05,7.62) 39(-21.59,7.62) 40(-24.13,7.62)
HDR-TH_3P-P2.54-V-M-1
  rect 1.575x1.8 hole 1.2: 1(-2.54,0)
  round 1.8 hole 1.2: 2(0,0) 3(2.54,0)
HDR-TH_4P-P2.54-V-F
  rect 1.7x1.7 hole 1.1: 1(-3.81,0)
  round 1.7 hole 1.1: 2(-1.27,0) 3(1.27,0) 4(3.81,0)
MIC-TH_BD6.0-P2.00
  rect 1.3x1.3 hole 0.7: 1(-1,0)
  round 1.3 hole 0.7: 2(1,0)

## Nets
As in the schematic, except:
DATA-A0(S): H6.3 U8.25

Pads without a net: H4 2 3; H8 2 3; U7 3 4 7 10 11 12 13 14 15 16; U8 1 2 4 5 8 9 10 11 12 13 14 15 19 21 22 23 24 29 30 31 32 33 34 35 36 37 38 39 40
